# EAGLE schematic brose_24v_logic (EAGLE 7.7.0)
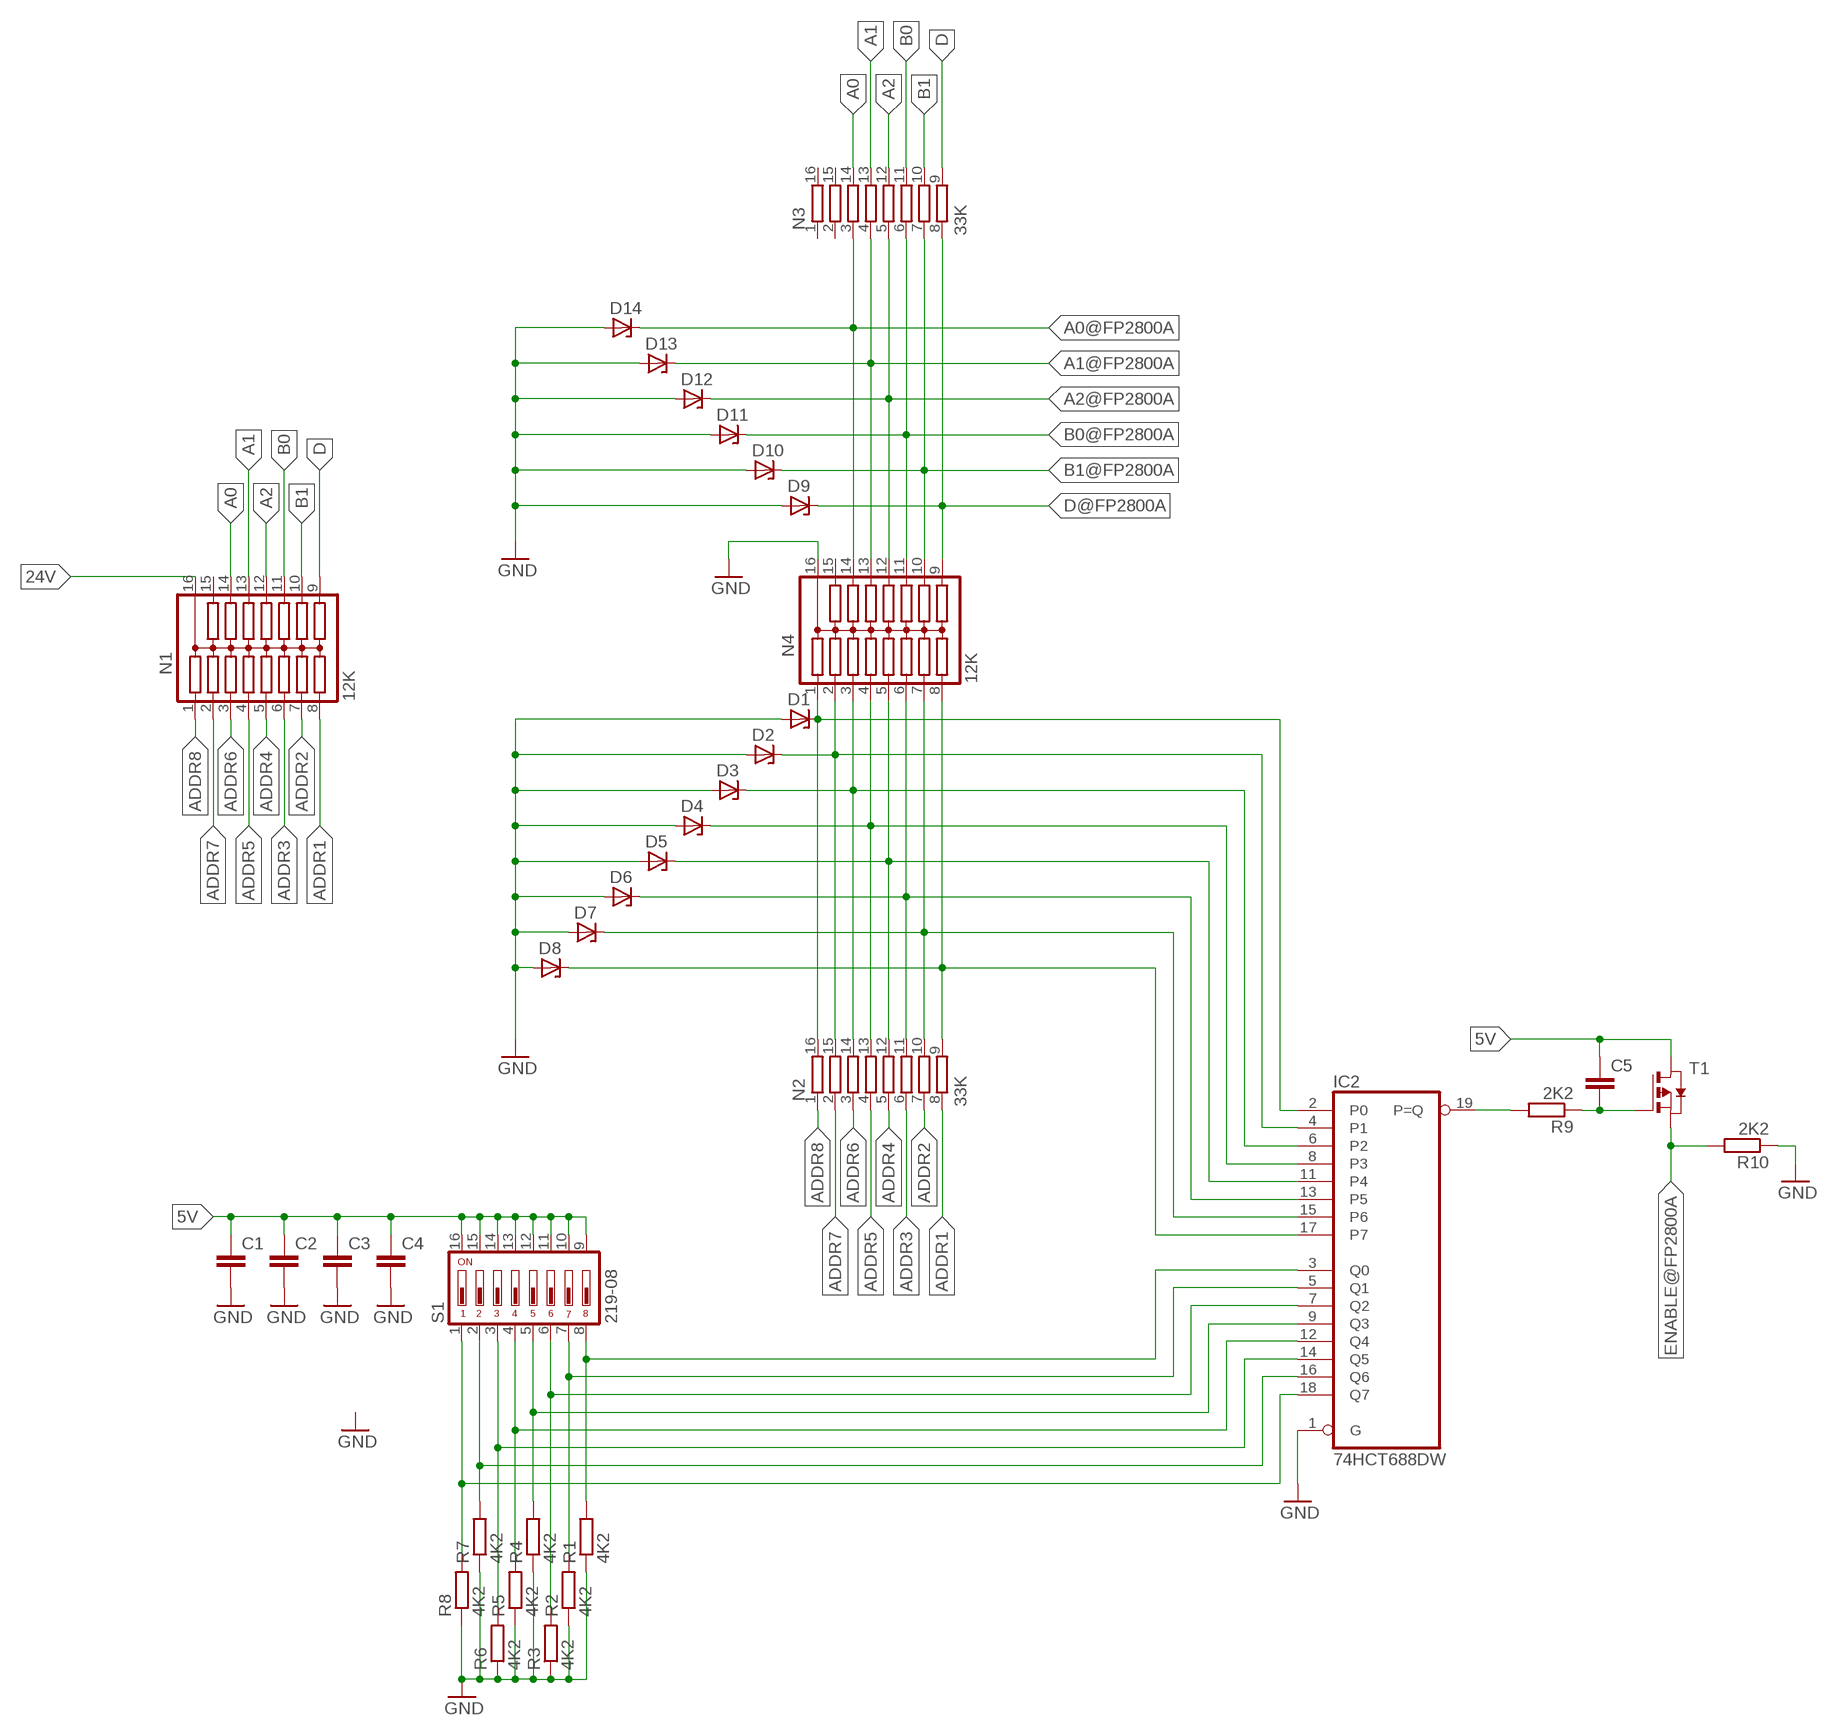
[diagram p0: schematic, sheet 1]

## Parts
C1  C-EUC1206  [C1206]
C2  C-EUC1206  [C1206]
C3  C-EUC1206  [C1206]
C4  C-EUC1206  [C1206]
C5  C-EUC1206  [C1206]
D1  ZENER-DIODESMB  [SMB]
D2  ZENER-DIODESMB  [SMB]
D3  ZENER-DIODESMB  [SMB]
D4  ZENER-DIODESMB  [SMB]
D5  ZENER-DIODESMB  [SMB]
D6  ZENER-DIODESMB  [SMB]
D7  ZENER-DIODESMB  [SMB]
D8  ZENER-DIODESMB  [SMB]
D9  ZENER-DIODESMB  [SMB]
D10  ZENER-DIODESMB  [SMB]
D11  ZENER-DIODESMB  [SMB]
D12  ZENER-DIODESMB  [SMB]
D13  ZENER-DIODESMB  [SMB]
D14  ZENER-DIODESMB  [SMB]
IC2  74HCT688DW  [SO20W]
N1  12K  15RSOMC  [SOMC16]
N2  33K  4816P-T01  [4816P]
N3  33K  4816P-T01  [4816P]
N4  12K  15RSOMC  [SOMC16]
R1  4K2  R-EU_R1206  [R1206]
R2  4K2  R-EU_R1206  [R1206]
R3  4K2  R-EU_R1206  [R1206]
R4  4K2  R-EU_R1206  [R1206]
R5  4K2  R-EU_R1206  [R1206]
R6  4K2  R-EU_R1206  [R1206]
R7  4K2  R-EU_R1206  [R1206]
R8  4K2  R-EU_R1206  [R1206]
R9  2K2  R-EU_R1206  [R1206]
R10  2K2  R-EU_R1206  [R1206]
S1  219-08  [CTS-219-08]
T1  PMOSSOT23  [SOT-23]

## Nets
5V: C1.1 C2.1 C3.1 C4.1 C5.1 S1.9 S1.10 S1.11 S1.12 S1.13 S1.14 S1.15 S1.16 T1.1(D)
24V: N1.16
A0: N1.14 N3.14
A0@FP2800A: D14.C N3.3 N4.14
A1: N1.13 N3.13
A1@FP2800A: D13.C N3.4 N4.13
A2: N1.12 N3.12
A2@FP2800A: D12.C N3.5 N4.12
ADDR1: N1.8 N2.8
ADDR2: N1.7 N2.7
ADDR3: N1.6 N2.6
ADDR4: N1.5 N2.5
ADDR5: N1.4 N2.4
ADDR6: N1.3 N2.3
ADDR7: N1.2 N2.2
ADDR8: N1.1 N2.1
B0: N1.11 N3.11
B0@FP2800A: D11.C N3.6 N4.11
B1: N1.10 N3.10
B1@FP2800A: D10.C N3.7 N4.10
D: N1.9 N3.9
D@FP2800A: D9.C N3.8 N4.9
ENABLE@FP2800A: R10.2 T1.2(S)
GND: C1.2 C2.2 C3.2 C4.2 D1.A D2.A D3.A D4.A D5.A D6.A D7.A D8.A D9.A D10.A D11.A D12.A D13.A D14.A IC2.1(G) N4.16 R1.1 R2.1 R3.1 R4.1 R5.1 R6.1 R7.1 R8.1 R10.1
N$1: IC2.12(Q4) R5.2 S1.4
N$2: IC2.3(Q0) R1.2 S1.8
N$3: IC2.7(Q2) R3.2 S1.6
N$4: IC2.16(Q6) R7.2 S1.2
N$5: IC2.18(Q7) R8.2 S1.1
N$6: IC2.14(Q5) R6.2 S1.3
N$7: IC2.9(Q3) R4.2 S1.5
N$8: IC2.5(Q1) R2.2 S1.7
N$9: D8.C IC2.17(P7) N2.9 N4.8
N$10: D7.C IC2.15(P6) N2.10 N4.7
N$11: D6.C IC2.13(P5) N2.11 N4.6
N$12: D5.C IC2.11(P4) N2.12 N4.5
N$13: D4.C IC2.8(P3) N2.13 N4.4
N$14: D3.C IC2.6(P2) N2.14 N4.3
N$15: D2.C IC2.4(P1) N2.15 N4.2
N$16: D1.C IC2.2(P0) N2.16 N4.1
N$23: IC2.19(P=Q) R9.2
N$24: C5.2 R9.1 T1.3(G)
Unconnected: N1.15 N3.1 N3.2 N3.15 N3.16 N4.15

## Power pins joined to a net without a drawn wire
GND: IC2.10(GND)
VCC: IC2.20(VCC)

## Library data of the parts
C1-C5 = resistor:C-EU: CAPACITOR, European symbol
D1-D14 = diode:ZENER-DIODE: Z-Diode
IC2 = 74xx-eu:74*688: 8-bit MAGNITUDE/IDENTITY COMPARATOR, totem pole
N1 N4 = resistor-dil:15R: DIL RESISTOR; MPN: SOMC160115R0GDC; OC_FARNELL: unknown; OC_NEWARK: 48P4651
N2 N3 = resistor-bourns:4816P-T01: BOURNS RESISTOR NETWORK; MF: BOURNS, INC.; MPN: 4816P-T01-684LF; OC_FARNELL: 9357483; OC_NEWARK: 33K0707
R1-R10 = resistor:R-EU_: RESISTOR, European symbol
S1 = switch-dil:219-08*: Surface Mount DIP Switch Series 219 SMT CTS Electronic Components Sourc: www.ctscorp.com; OC_FARNELL: unknown; OC_NEWARK: unknown
T1 = zetex:PMOSSOT23: MOS FET; OC_FARNELL: unknown; OC_NEWARK: unknown